# EAGLE design hairpinfilter (EAGLE 5.12)
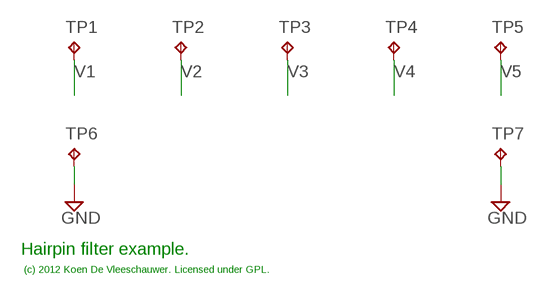
[diagram p0: schematic, sheet 1]

## Parts
TP1  TPTP10SQ  [TP10SQ]
TP2  TPTP10SQ  [TP10SQ]
TP3  TPTP10SQ  [TP10SQ]
TP4  TPTP10SQ  [TP10SQ]
TP5  TPTP10SQ  [TP10SQ]
TP6  TPTP10SQ  [TP10SQ]
TP7  TPTP10SQ  [TP10SQ]

## Nets
GND: TP6.TP TP7.TP
V1: TP1.TP
V2: TP2.TP
V3: TP3.TP
V4: TP4.TP
V5: TP5.TP

## Notes on the sheet
- Hairpin filter example.
- (c) 2012 Koen De Vleeschauwer. Licensed under GPL.

## Library data of the parts
TP1-TP7 = testpad:TP: Test pad

## Board
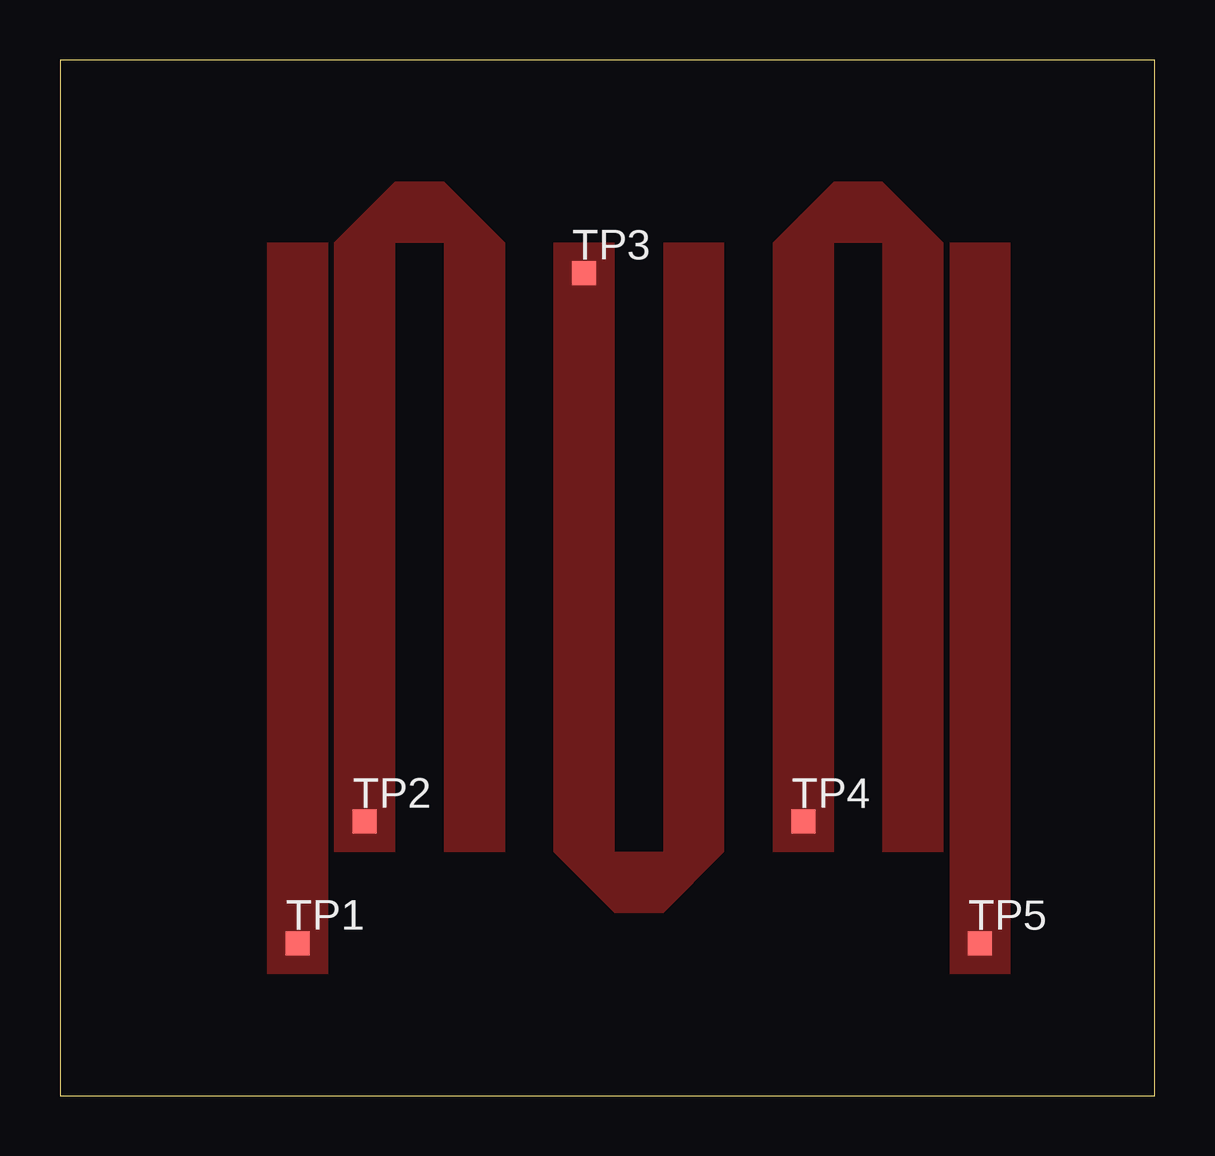
[diagram p1: board, top side]
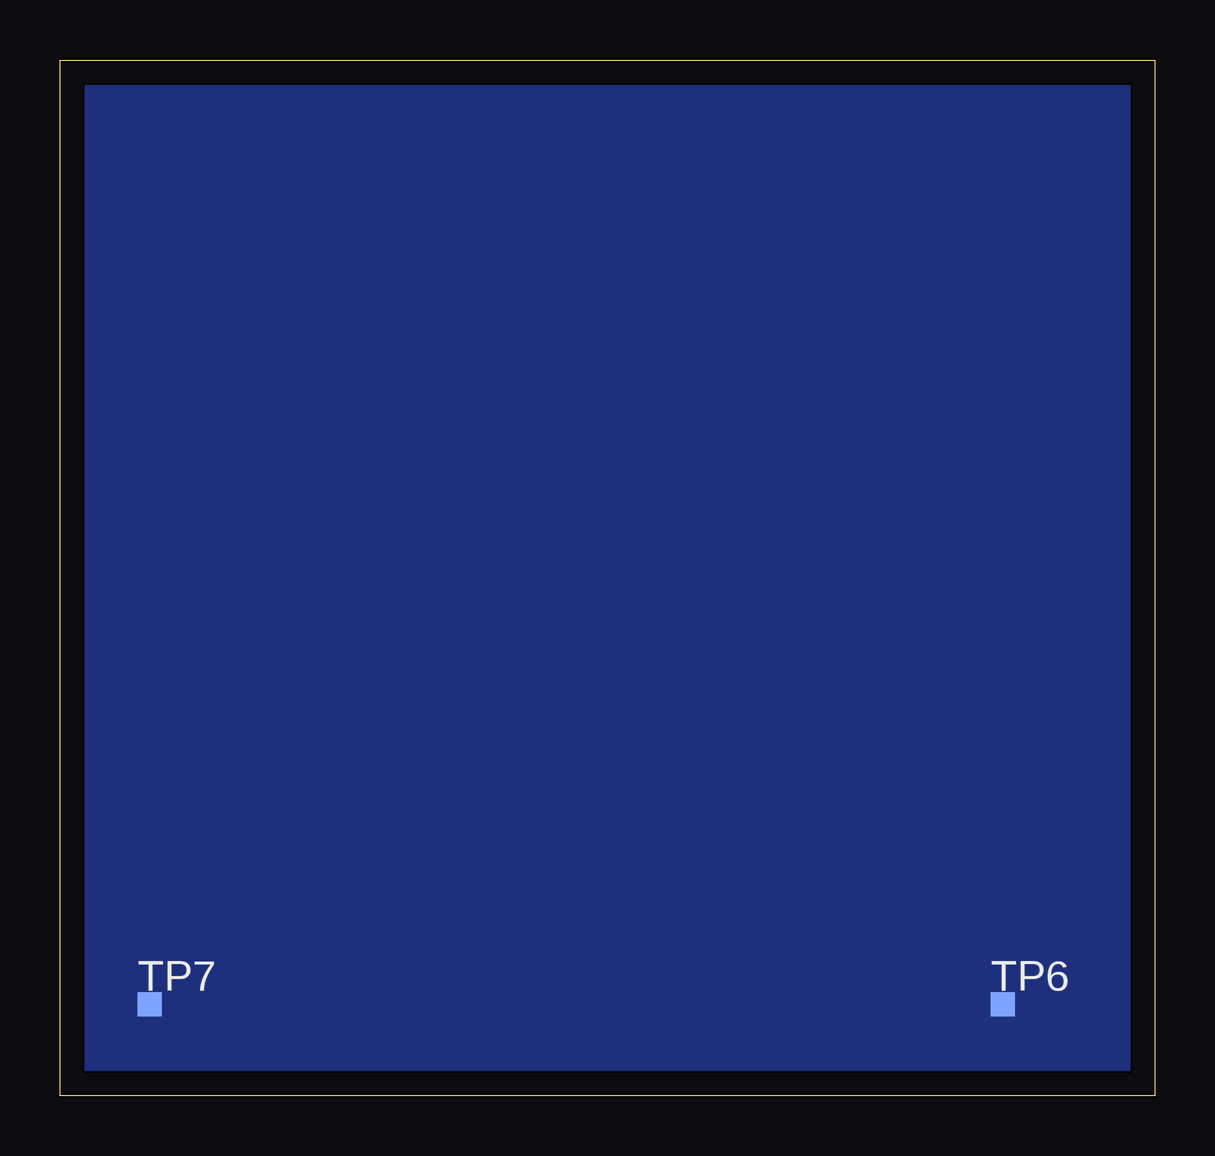
[diagram p2: board, bottom side, seen from below]

Size 45.64 x 43.17 mm. Coordinates in mm from the lower left corner, seen from the top.
Outline: 0,0 45.64,0 45.64,43.17 0,43.17 0,0
Copper layers (1*16): Top 0.035mm / dielectric 1.5mm / Bottom 0.035mm
Design rules "default": minimum track width 10mil, minimum drill 24mil, track to track 8mil, track to pad 8mil, pad to pad 8mil, via to via 8mil, smd to smd 8mil, copper to edge 40mil, drill to drill 8mil, minimum pad ring 10mil, minimum via ring 8mil, stop-mask expansion 4mil, vias tented up to drill 0mil, thermal gap 10mil

### Footprints (pad centres in the part's own frame; a part is rotated, then mirrored left to right if it is on the bottom)
TP10SQ = smd 1 x 1: TP 0,0

### Placement (x,y rotation side)
TP1  9.91,6.35 0 top
TP2  12.7,11.43 0 top
TP3  21.84,34.29 0 top
TP4  30.99,11.43 0 top
TP5  38.35,6.35 0 top
TP6  6.35,3.81 0 bottom
TP7  41.91,3.81 0 bottom

### Tracks (layer width: path | path; a pad name or v marks a point on that pad's centre or on a via)
GND
  pour Bottom (no thermals): 0,43.18 45.72,43.18 45.72,0 0,0
V1
  pour Top (no thermals): 11.18,5.08 11.18,35.56 8.64,35.56 8.64,5.08
V2
  pour Top (no thermals): 18.54,10.16 18.54,35.56 16,38.1 13.97,38.1 11.43,35.56 11.43,10.16 13.97,10.16 13.97,35.56 16,35.56 16,10.16
V3
  pour Top (no thermals): 20.57,35.56 20.57,10.16 23.11,7.62 25.15,7.62 27.69,10.16 27.69,35.56 25.15,35.56 25.15,10.16 23.11,10.16 23.11,35.56
V4
  pour Top (no thermals): 36.83,10.16 36.83,35.56 34.29,38.1 32.26,38.1 29.72,35.56 29.72,10.16 32.26,10.16 32.26,35.56 34.29,35.56 34.29,10.16
V5
  pour Top (no thermals): 39.62,5.08 39.62,35.56 37.08,35.56 37.08,5.08

### Text on the board
Document: Hairpin filter | (c) 2012 Koen De Vleeschauwer. Licensed under GPL. | See "Recipes for printed hairpin filters", by Paul Wade, W1GHZ